# EAGLE design Bike-Power-PCB (EAGLE 7.2.0)
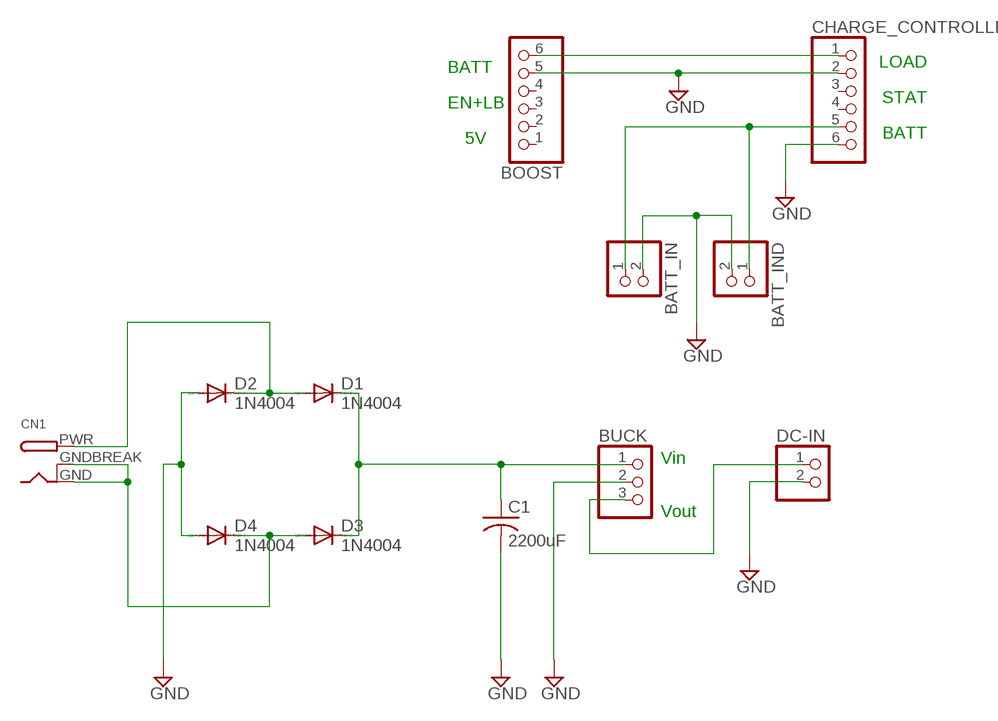
[diagram p0: schematic, sheet 1]

## Parts
BATT_IN  JST_2PIN-SMT-RA  [JST-PH-2-SMT-RA]
BATT_IND  PINHD-1X2  [1X02]
BOOST  PINHD-1X6  [1X06]
BUCK  PINHD-1X3  [1X03]
C1  2200uF  C-USC0805  [C0805]
CHARGE_CONTROLLER  PINHD-1X6  [1X06]
CN1  DCBARRELPTH  [DCJACK_2MM_PTH]
D1  1N4004  [DO41-10]
D2  1N4004  [DO41-10]
D3  1N4004  [DO41-10]
D4  1N4004  [DO41-10]
DC-IN  PINHD-1X2  [1X02]

## Nets
GND: BATT_IN.2 BATT_IND.2 BOOST.5 BUCK.2 C1.2 CHARGE_CONTROLLER.2 CHARGE_CONTROLLER.6 D2.A D4.A DC-IN.2
N$1: BUCK.1 C1.1 D1.C D3.C
N$2: CN1.GND CN1.GNDBREAK D3.A D4.C
N$3: CN1.PWR D1.A D2.C
N$4: BUCK.3 DC-IN.1
N$5: BATT_IN.1 BATT_IND.1 CHARGE_CONTROLLER.5
N$7: BOOST.6 CHARGE_CONTROLLER.1
Unconnected: BOOST.1 BOOST.2 BOOST.3 BOOST.4 CHARGE_CONTROLLER.3 CHARGE_CONTROLLER.4

## Notes on the sheet
- LOAD
- BATT
- STAT
- EN+LB
- BATT
- 5V
- Vin
- Vout

## Library data of the parts
BATT_IN = adafruit:JST_2PIN: JST 2-Pin Connectors of various flavors SMT-RA (S2B-PH-SM4) 4UConnector #17311 SMT (B2B-PH-SM4) THM-RA (S2B-PH) THM (B2B-PH)
BATT_IND DC-IN = pinhead:PINHD-1X2: PIN HEADER
BOOST CHARGE_CONTROLLER = pinhead:PINHD-1X6: PIN HEADER
BUCK = adafruit:PINHD-1X3: PIN HEADER
C1 = adafruit:C-US: CAPACITOR, American symbol
CN1 = adafruit:DCBARREL: 2.0mm DC Barrel Jack DCJACK_2MM_PTH - Through Hole Jack (4UConnector: 05537)
D1-D4 = diode:1N4004: DIODE general purpose rectifier, 1 A

## Net classes
0 default: width 0.305 mm, drill 0.508 mm, clearance 0.254 mm

## Board
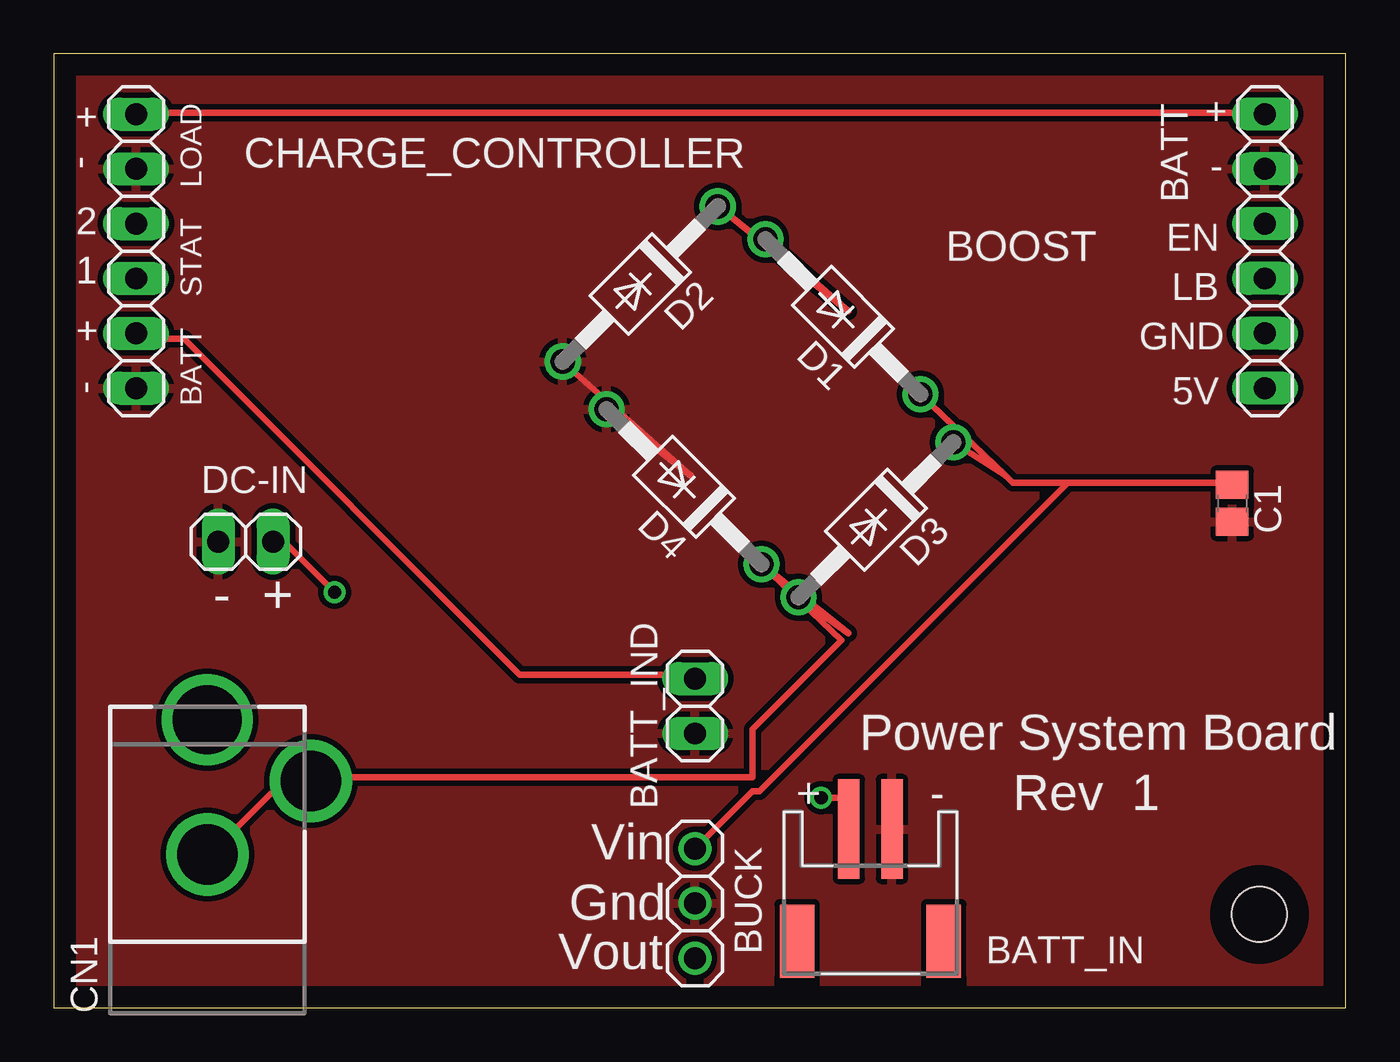
[diagram p1: board, top side]
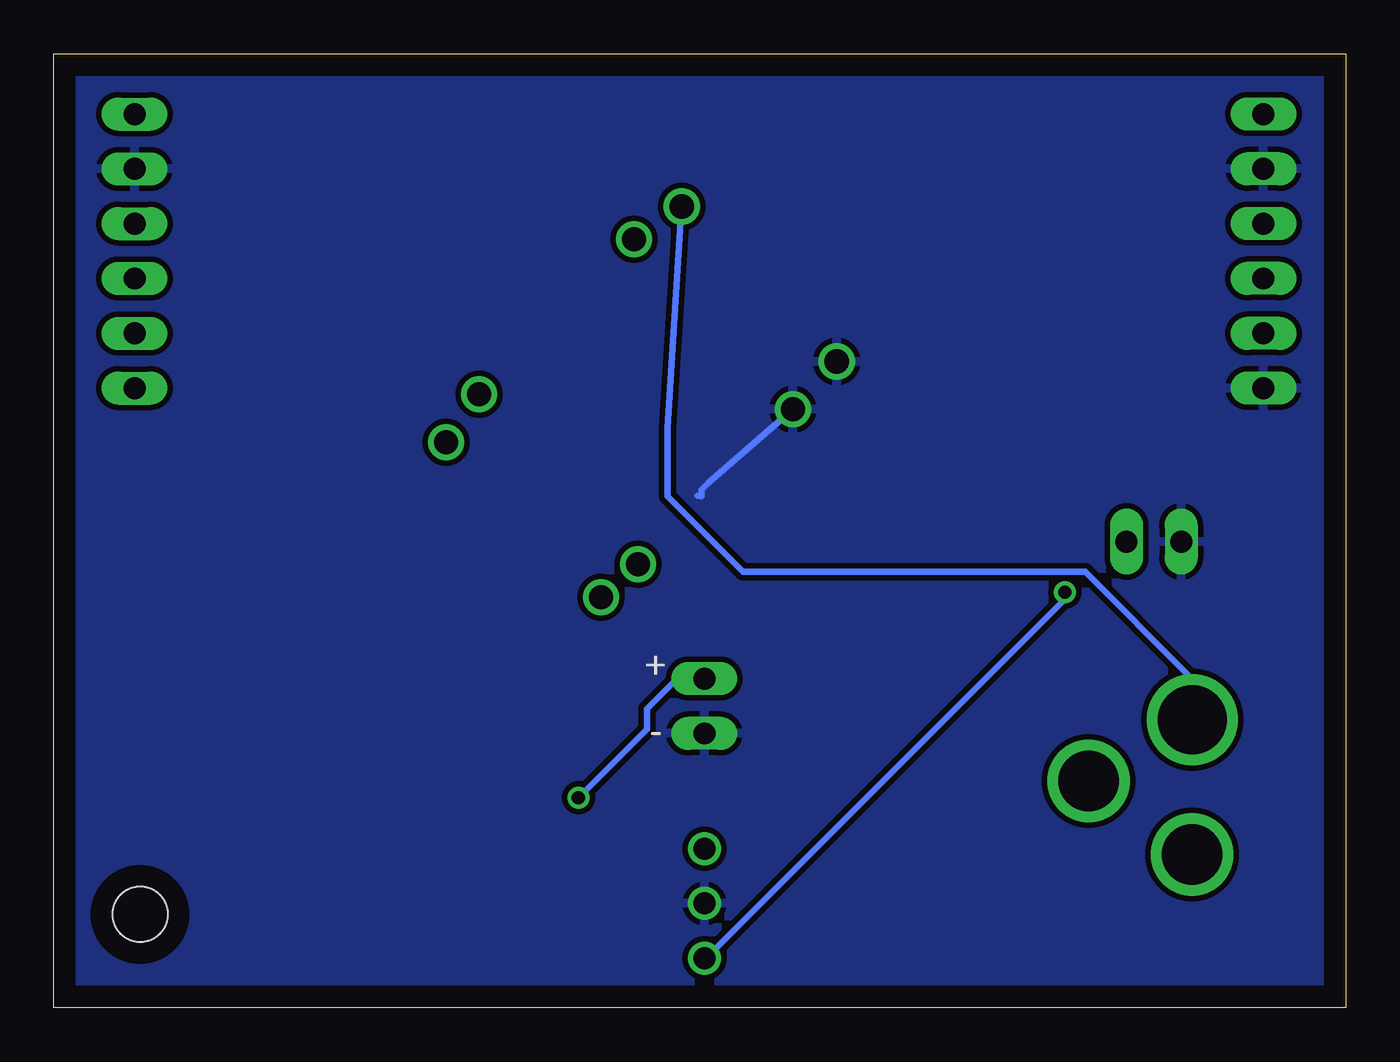
[diagram p2: board, bottom side, seen from below]

Size 59.87 x 44.19 mm. Coordinates in mm from the lower left corner, seen from the top.
Outline: 0,0 59.87,0 59.87,44.19 0,44.19 0,0
Copper layers (1*16): Top 0.035mm / dielectric 1.5mm / Bottom 0.035mm
Design rules "default *": minimum track width 10mil, minimum drill 20mil, track to track 8mil, track to pad 8mil, pad to pad 8mil, via to via 8mil, smd to smd 8mil, copper to edge 40mil, drill to drill 8mil, minimum pad ring 10mil, minimum via ring 8mil, stop-mask expansion 4mil, vias tented up to drill 0mil, thermal gap 10mil
Holes 2.54 mm at 55.88,4.32

### Footprints (pad centres in the part's own frame; a part is rotated, then mirrored left to right if it is on the bottom)
JST-PH-2-SMT-RA = smd 1 x 4.6: 1 1,-3.7; 2 -1,-3.7 | smd 1.6 x 3.4: NC1 -3.4,1.5; NC2 3.4,1.5
1X02 = drill 1.016 long: 1 -1.27,0; 2 1.27,0
1X06 = drill 1.016 long: 1 -6.35,0; 2 -3.81,0; 3 -1.27,0; 4 1.27,0; 5 3.81,0; 6 6.35,0
1X03 = drill 1.016: 1 -2.54,0; 2 0,0; 3 2.54,0
C0805 = smd 1.3 x 1.5: 1 -0.85,0; 2 0.85,0
DCJACK_2MM_PTH = drill 2.8: GND 0,7.35; GNDBREAK 4.8,10.75 | drill 3.2: PWR 0,13.6
DO41-10 = drill 1.118: A 5.08,0; C -5.08,0

### Placement (x,y rotation side)
BATT_IN  37.85,4.57 180 top
BATT_IND  29.72,13.97 270 top
BOOST  56.13,35.05 90 top
BUCK  29.72,4.83 270 top
C1  54.61,23.37 270 top
CHARGE_CONTROLLER  3.81,35.05 270 top
CN1  7.11,-0.25 0 top
D1  36.58,32 135 top
D2  27.18,33.53 225 top
D3  38.1,22.61 225 top
D4  29.21,24.13 135 top
DC-IN  8.89,21.59 180 top

### Tracks (layer width: path | path; a pad name or v marks a point on that pad's centre or on a via)
GND
  Top 0.305: D4.A 29.53,24.64 D2.A
  Bottom 0.305: D4.A 29.53,24.32 29.84,24 29.84,23.68 30.03,23.71
  pour Bottom: 0,44.96 60.96,44.96 60.96,-0.76 -1.27,-0.76 -1.27,44.96
  pour Top: -1.27,44.96 60.96,44.96 60.96,43.69 60.96,-0.76 -1.27,-0.76
N$1
  Top 0.305: 46.99,24.32 44.45,24.32 D1.C 44.13,24.64 D3.C | 46.99,24.32 54.61,24.32 C1.1 | BUCK.1 32.38,10.03 32.7,10.03 46.99,24.32
N$2
  Top 0.305: D3.A 36.83,17.34 D4.C 36.51,17.02 32.38,12.89 32.38,10.67 12.06,10.67 CN1.GNDBREAK 11.75,10.35 10.48,10.35 7.3,7.18 CN1.GND
N$3
  Top 0.305: D2.C 36.83,32.26 D1.A
  Bottom 0.305: D2.C 31.43,26.86 31.43,23.68 27.94,20.19 12.06,20.19 7.3,15.43 7.3,13.53 CN1.PWR
N$4  (via drill 0.61)
  Top 0.305: v13.02,19.24 10.79,21.46 10.16,21.46 DC-IN.1
  Bottom 0.305: v13.02,19.24 13.02,18.92 29.53,2.41 BUCK.3
N$5  (via drill 0.61)
  Top 0.305: CHARGE_CONTROLLER.5 3.81,30.99 6.03,30.99 21.59,15.43 29.53,15.43 BATT_IND.1 | v35.56,9.71 36.83,9.71 36.83,7.81 BATT_IN.1
  Bottom 0.305: v35.56,9.71 32.38,12.89 32.38,13.84 31.11,15.11 29.84,15.11 BATT_IND.1
N$7
  Top 0.305: CHARGE_CONTROLLER.1 3.81,41.47 57.15,41.47 BOOST.6

### Text on the board
tNames: + | LOAD | BATT | + | - | - | STAT | 2 | EN | 1 | LB | BATT | + | GND | - | 5V | - | + | Power System Board | Rev 1 | Vin | Gnd | Vout
bNames: + | -